# Altium schematic sheet debugging_board_3.SchDoc
size A4
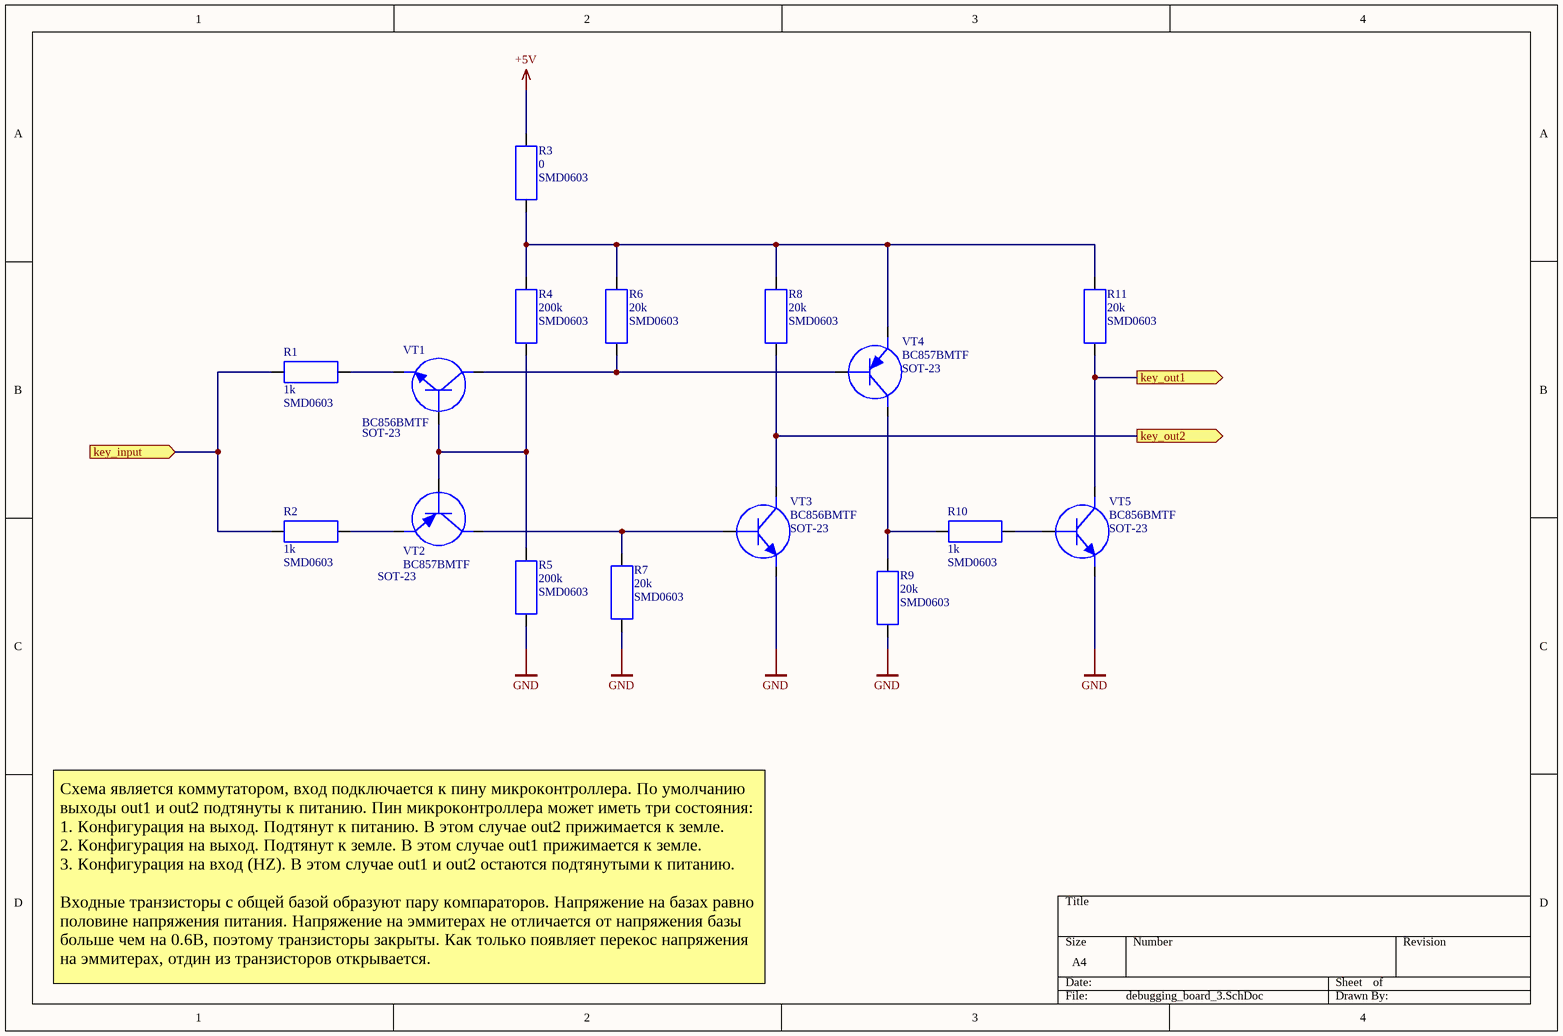
[diagram p0: debugging_board_3.SchDoc]

## Parts
R1  1k  Package: SMD0603  [SMD0603(1005)]
R2  1k  Package: SMD0603  [SMD0603(1005)]
R3  0  Package: SMD0603  [SMD0603(1005)]
R4  200k  Package: SMD0603  [SMD0603(1005)]
R5  200k  Package: SMD0603  [SMD0603(1005)]
R6  20k  Package: SMD0603  [SMD0603(1005)]
R7  20k  Package: SMD0603  [SMD0603(1005)]
R8  20k  Package: SMD0603  [SMD0603(1005)]
R9  20k  Package: SMD0603  [SMD0603(1005)]
R10  1k  Package: SMD0603  [SMD0603(1005)]
R11  20k  Package: SMD0603  [SMD0603(1005)]
VT1  BC856BMTF  Package: SOT-23  [SOT23-3]
VT2  BC857BMTF  Package: SOT-23  [SOT23-3]
VT3  BC856BMTF  Package: SOT-23  [SOT23-3]
VT4  BC857BMTF  Package: SOT-23  [SOT23-3]
VT5  BC856BMTF  Package: SOT-23  [SOT23-3]

## Ports
key_input (in), key_out1 (out), key_out2 (out)

## Nets
+5V: R3.1
GND: R5.2 R7.2 R9.2 VT3.2 VT5.2
key_input: R1.2 R2.2 ; port key_input
key_out1: R11.2 VT5.3 ; port key_out1
key_out2: R8.2 VT3.3 ; port key_out2
NetR1_1: R1.1 VT1.2
NetR2_1: R2.1 VT2.2
NetR3_2: R3.2 R4.1 R6.1 R8.1 R11.1 VT4.2
NetR4_2: R4.2 R5.1 VT1.1 VT2.1
NetR6_2: R6.2 VT1.3 VT4.1
NetR7_1: R7.1 VT2.3 VT3.1
NetR9_1: R9.1 R10.2 VT4.3
NetR10_1: R10.1 VT5.1

## Notes on the sheet
- Схема является коммутатором, вход подключается к пину микроконтроллера. По умолчанию выходы out1 и out2 подтянуты к питанию. Пин микроконтроллера может иметь три состояния:
  1. Конфигурация на выход. Подтянут к питанию. В этом случае out2 прижимается к земле.
  2. Конфигурация на выход. Подтянут к земле. В этом случае out1 прижимается к земле.
  3. Конфигурация на вход (HZ). В этом случае out1 и out2 остаются подтянутыми к питанию.
  Входные транзисторы с общей базой образуют пару компараторов. Напряжение на базах равно половине напряжения питания. Напряжение на эммитерах не отличается от напряжения базы больше чем на 0.6В, поэтому транзисторы закрыты. Как только появляет перекос напряжения на эммитерах, отдин из транзисторов открывается.

## Library data of the parts
R1 R2 R10 = R_0603: ValueBOM: Резистор 1кОм SMD 0603 1%; Type: R; Value: 1k
R3 = R_0603: ValueBOM: Резистор 0 Ом SMD 0603 1%; Type: R; Value: 0
R4 R5 = R_0603: ValueBOM: Резистор 200кОм SMD 0603 1%; Type: R; Value: 200k
R6-R9 R11 = R_0603: ValueBOM: Резистор 20кОм SMD 0603 1%; Type: R; Value: 20k
VT1 VT3 VT5 = VT_NPN_SOT23_3: Type: VT; ValueBOM: Транзистор биполярный NPN BC856BMTF SOT23; Value: BC856BMTF
VT2 VT4 = VT_PNP_SOT23_3: Type: VT; ValueBOM: Транзистор биполярный PNP BC857BMTF SOT23; Value: BC857BMTF